# EAGLE schematic raspi (EAGLE 6.4)
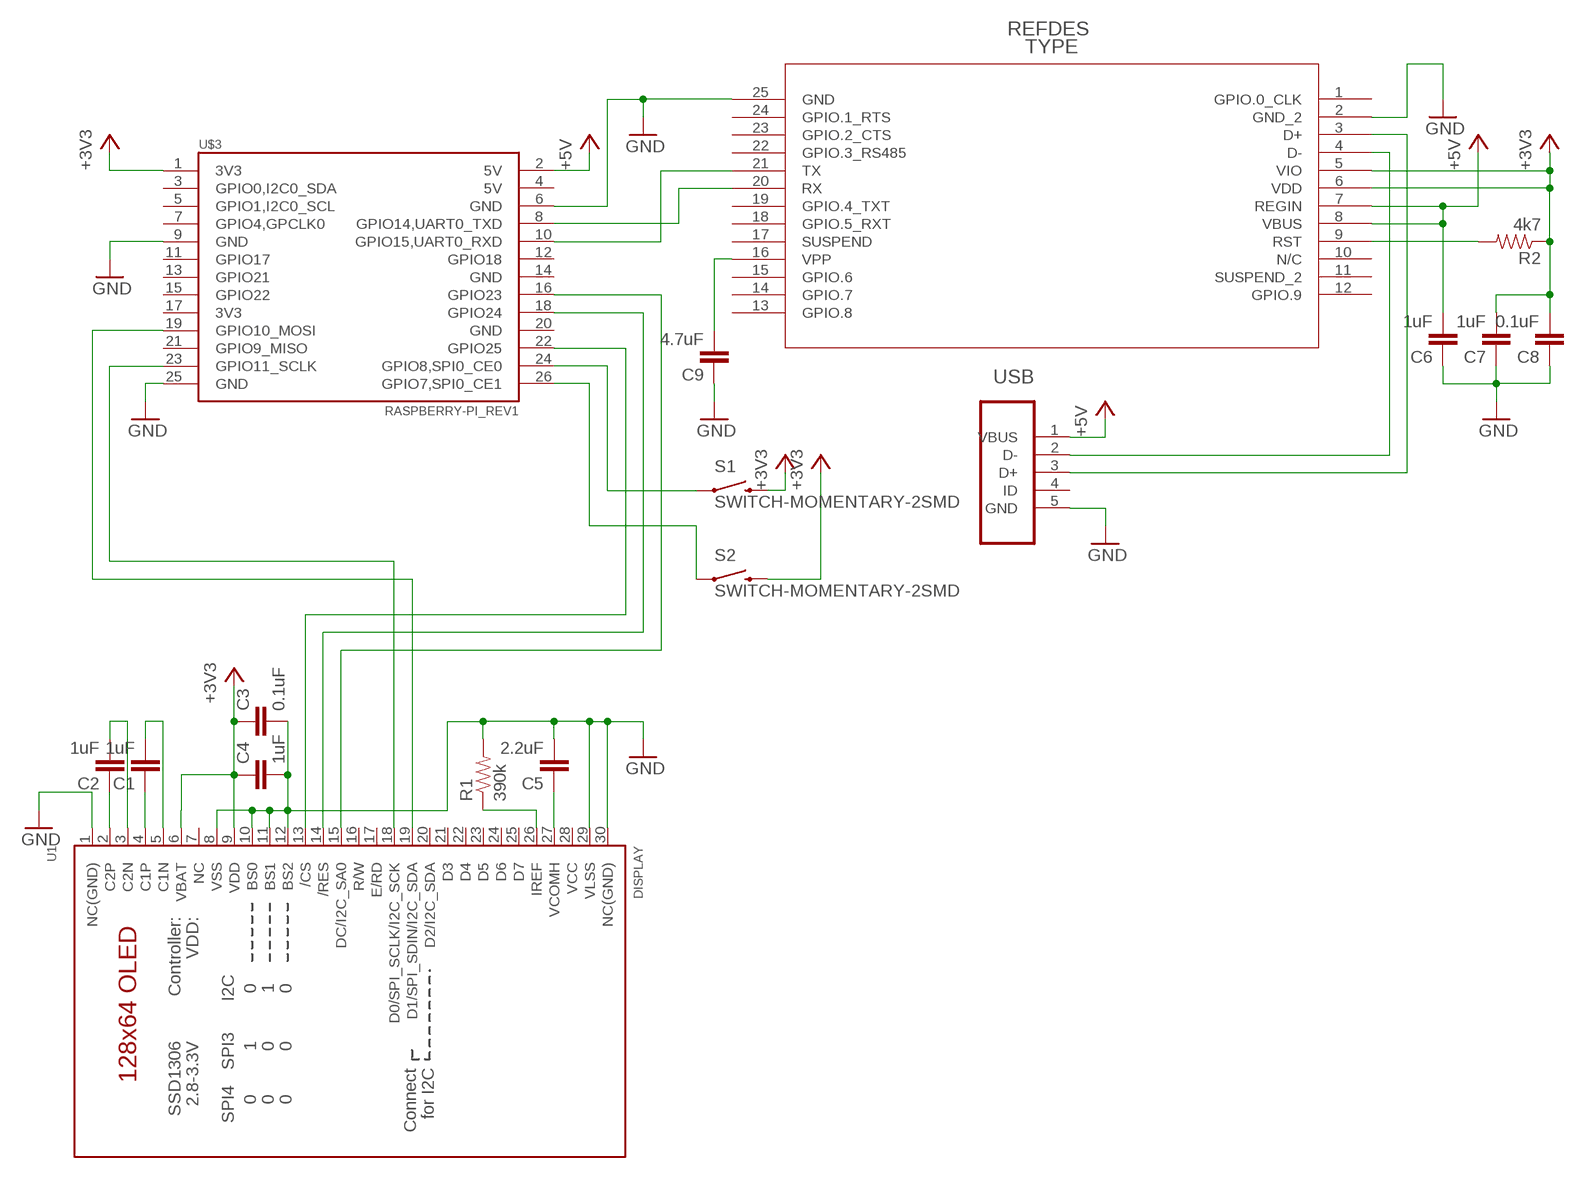
[diagram p0: schematic, sheet 1]

## Parts
C1  1uF  CAP0805  [0805]
C2  1uF  CAP0805  [0805]
C3  0.1uF  CAP0805  [0805]
C4  1uF  CAP0805  [0805]
C5  2.2uF  CAP0805  [0805]
C6  1uF  CAP0805  [0805]
C7  1uF  CAP0805  [0805]
C8  0.1uF  CAP0805  [0805]
C9  4.7uF  CAP0805  [0805]
R1  390k  RESISTOR0805-RES  [0805]
R2  4k7  RESISTOR0805-RES  [0805]
S1  SWITCH-MOMENTARY-2SMD  [TACTILE_SWITCH_SMD]
S2  SWITCH-MOMENTARY-2SMD  [TACTILE_SWITCH_SMD]
U1  DISPLAY  DISP_OLED_UG-2864HSWEG010.96"  [UG-2864HSWEG01_0.96IN_WRAPAROUND]
U2  CP2110-F01-GM  [CP2110-F01-GM]
U$3  RASPBERRY-PI_REV1  [RASPBERRY-PI_REV1]
USB  47346-0001  [MOLEX_47346-0001]

## Nets
+3V3: C3.1 C4.1 C7.2 C8.2 R2.1 S1.3 S2.3 U1.6(VBAT) U1.9(VDD) U2.5(VIO) U2.6(VDD) U$3.1(3V3)
+5V: C6.2 U2.7(REGIN) U2.8(VBUS) U$3.2(5V) USB.1(VBUS)
GND: C3.2 C4.2 C5.2 C6.1 C7.1 C8.1 C9.1 R1.2 U1.1(NC(GND)) U1.8(VSS) U1.10(BS0) U1.11(BS1) U1.12(BS2) U1.29(VLSS) U1.30(NC(GND)) U2.2(GND_2) U2.25(GND) U$3.6(GND) U$3.9(GND) U$3.25(GND) USB.5(GND)
N$1: U1.19(D1/SPI_SDIN/I2C_SDA) U$3.19(GPIO10_MOSI)
N$2: S2.1 U$3.26(GPIO7,SPI0_CE1)
N$3: S1.1 U$3.24(GPIO8,SPI0_CE0)
N$4: U1.15(DC/I2C_SA0) U$3.16(GPIO23)
N$5: U1.18(D0/SPI_SCLK/I2C_SCK) U$3.23(GPIO11_SCLK)
N$6: C5.1 U1.27(VCOMH)
N$7: U1.13(/CS) U$3.22(GPIO25)
N$8: U1.14(/RES) U$3.18(GPIO24)
N$9: R1.1 U1.26(IREF)
N$10: C2.1 U1.2(C2P)
N$11: C1.1 U1.4(C1P)
N$12: C2.2 U1.3(C2N)
N$13: C1.2 U1.5(C1N)
N$14: C9.2 U2.16(VPP)
N$16: U2.21(TX) U$3.10(GPIO15,UART0_RXD)
N$17: U2.20(RX) U$3.8(GPIO14,UART0_TXD)
N$20: R2.2 U2.9(RST)
USB_D_N: U2.4(D-) USB.2(D-)
USB_D_P: U2.3(D+) USB.3(D+)
Unconnected: U1.7(NC) U1.16(R/W) U1.17(E/RD) U1.20(D2/I2C_SDA) U1.21(D3) U1.22(D4) U1.23(D5) U1.24(D6) U1.25(D7) U2.1(GPIO.0_CLK) U2.10(N/C) U2.11(SUSPEND_2) U2.12(GPIO.9) U2.13(GPIO.8) U2.14(GPIO.7) U2.15(GPIO.6) U2.17(SUSPEND) U2.18(GPIO.5_RXT) U2.19(GPIO.4_TXT) U2.22(GPIO.3_RS485) U2.23(GPIO.2_CTS) U2.24(GPIO.1_RTS) U$3.3(GPIO0,I2C0_SDA) U$3.4(5V) U$3.5(GPIO1,I2C0_SCL) U$3.7(GPIO4,GPCLK0) U$3.11(GPIO17) U$3.12(GPIO18) U$3.13(GPIO21) U$3.14(GND) U$3.15(GPIO22) U$3.17(3V3) U$3.20(GND) U$3.21(GPIO9_MISO) USB.4(ID)

## Power pins joined to a net without a drawn wire
VCC: U1.28(VCC)

## Library data of the parts
C1-C9 = SparkFun-Capacitors:CAP: Capacitor Standard 0603 ceramic capacitor, and 0.1" leaded capacitor.
R1 R2 = SparkFun-Resistors:RESISTOR: Resistor Basic schematic elements and footprints for 0603, 1206, and PTH resistors.
S1 S2 = SparkFun-Electromechanical:SWITCH-MOMENTARY-2: Various NO switches- pushbuttons, reed, etc
U1 = microbuilder:DISP_OLED_UG-2864HSWEG01: UG-2864HSWEG01 OLED display Both 1.3" and 0.96" models share the same FPC tab footprint, only the screen dimensions vary.
U2 = bxl_import:CP2110-F01-GM
U$3 = RaspberryPi:RASPBERRY-PI_REV1: Raspberry Pi Board <http://www.raspberrypi.org/> Jacques Lagnel V1.0 (beta) 2012 Mateusz Bawaj V1.1 (beta) 2012 Board dimension: Forum 3D model <http://www.raspberrypi.org/forum/general-discussion/mechanical-profile-3d-models?value=3d%20model&type=1&include=1&search=1&ret=all> The GPIO Connector (P1): http://elinux.org/RPi_Low-level_peripherals
USB = fabhack:47346-0001: CONN RCPT 5POS MICRO USB R/A SMD; MPN: 47346-0001; OC_FARNELL: 1568026; OC_NEWARK: 47M0505; PACKAGE: 5 POS MICRO USB R/A; SUPPLIER: MOLEX